# EAGLE design weatherstation (EAGLE 7.1.0)
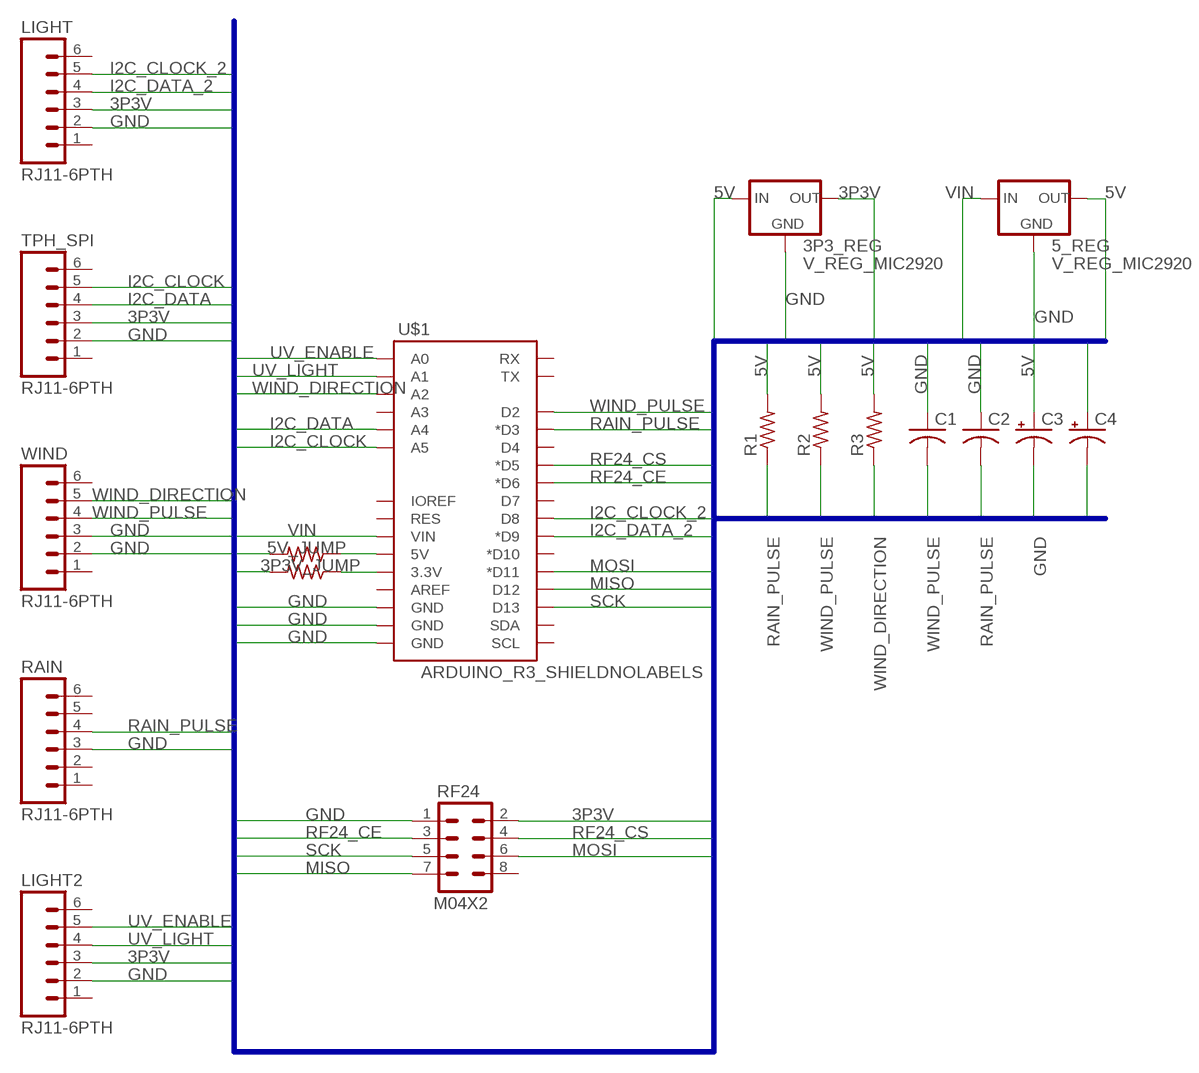
[diagram p0: schematic, sheet 1]

## Parts
3P3_REG  V_REG_MIC2920  [SOT223]
3P3V_JUMP  R-US_R0805  [R0805]
5_REG  V_REG_MIC2920  [SOT223]
5V_JUMP  R-US_R0805  [R0805]
C1  C-USC0805  [C0805]
C2  C-USC0805  [C0805]
C3  CPOL-USE2.5-6  [E2,5-6]
C4  CPOL-USE2.5-6  [E2,5-6]
LIGHT  RJ11-6PTH  [RJ11-6]
LIGHT2  RJ11-6PTH  [RJ11-6]
R1  R-US_R0805  [R0805]
R2  R-US_R0805  [R0805]
R3  R-US_R0805  [R0805]
RAIN  RJ11-6PTH  [RJ11-6]
RF24  M04X2  [2X4]
TPH_SPI  RJ11-6PTH  [RJ11-6]
U$1  ARDUINO_R3_SHIELDNOLABELS  [UNO_R3_SHIELD_NOLABELS]
WIND  RJ11-6PTH  [RJ11-6]

## Nets
3P3V: 3P3_REG.3(OUT) 3P3V_JUMP.2 C4.+ LIGHT2.3 LIGHT.3 RF24.2 TPH_SPI.3
5V: 3P3_REG.1(IN) 5_REG.3(OUT) 5V_JUMP.2 C3.+ R1.2 R2.2 R3.2
GND: 3P3_REG.2(GND) 5_REG.2(GND) C1.1 C2.1 C3.- C4.- LIGHT2.2 LIGHT.2 RAIN.3 RF24.1 TPH_SPI.2 U$1.GND@0(GND) U$1.GND@1(GND) U$1.GND@2(GND) WIND.2 WIND.3
I2C_CLOCK: TPH_SPI.5 U$1.A5
I2C_CLOCK_2: LIGHT.5 U$1.D8
I2C_DATA: TPH_SPI.4 U$1.A4
I2C_DATA_2: LIGHT.4 U$1.D9(*D9)
MISO: RF24.7 U$1.D12
MOSI: RF24.6 U$1.D11(*D11)
N$2: 3P3V_JUMP.1 U$1.3.3V
N$3: 5V_JUMP.1 U$1.5V
RAIN_PULSE: C2.2 R1.1 RAIN.4 U$1.D3(*D3)
RF24_CE: RF24.3 U$1.D6(*D6)
RF24_CS: RF24.4 U$1.D5(*D5)
SCK: RF24.5 U$1.D13
UV_ENABLE: LIGHT2.5 U$1.A0
UV_LIGHT: LIGHT2.4 U$1.A1
VIN: 5_REG.1(IN) U$1.VIN
WIND_DIRECTION: R3.1 U$1.A2 WIND.5
WIND_PULSE: C1.2 R2.1 U$1.D2 WIND.4
Unconnected: LIGHT2.1 LIGHT2.6 LIGHT.1 LIGHT.6 RAIN.1 RAIN.2 RAIN.5 RAIN.6 RF24.8 TPH_SPI.1 TPH_SPI.6 U$1.A3 U$1.AREF U$1.D4 U$1.D7 U$1.D10(*D10) U$1.IOREF U$1.RES U$1.RX U$1.SCL U$1.SDA U$1.TX WIND.1 WIND.6

## Buses
UV_LIGHT,UV_ENABLE,WIND_PULSE,RAIN_PULSE,GND,3P3V,5V,VIN,WIND_DIRECTION,I2C_DATA,I2C_DATA_2,I2C_CLOCK,I2C_CLOCK_2,MOSI,MISO,SCK,RF24_CS,RF24_CE

## Library data of the parts
3P3_REG 5_REG = SparkFun-PowerIC:V_REG_MIC2920: MIC2920A (http://www.micrel.com/_PDF/mic2920.pdf) - 400mA output LDO Regulator
3P3V_JUMP 5V_JUMP R1-R3 = rcl:R-US_: RESISTOR, American symbol
C1 C2 = rcl:C-US: CAPACITOR, American symbol
C3 C4 = rcl:CPOL-US: POLARIZED CAPACITOR, American symbol
LIGHT LIGHT2 RAIN TPH_SPI WIND = SparkFun-Connectors:RJ11-6: RJ11 Jack Simple 6 pin RJ11 jack. Commonly found on CAT3 devices and Microchip programmers. SKU: PRT-00132
RF24 = SparkFun-Connectors:M04X2: .1" header, two rows of four.
U$1 = SparkFun-Boards:ARDUINO_R3_SHIELD: Shield form compatible with the Arduino Uno R3.

## Board
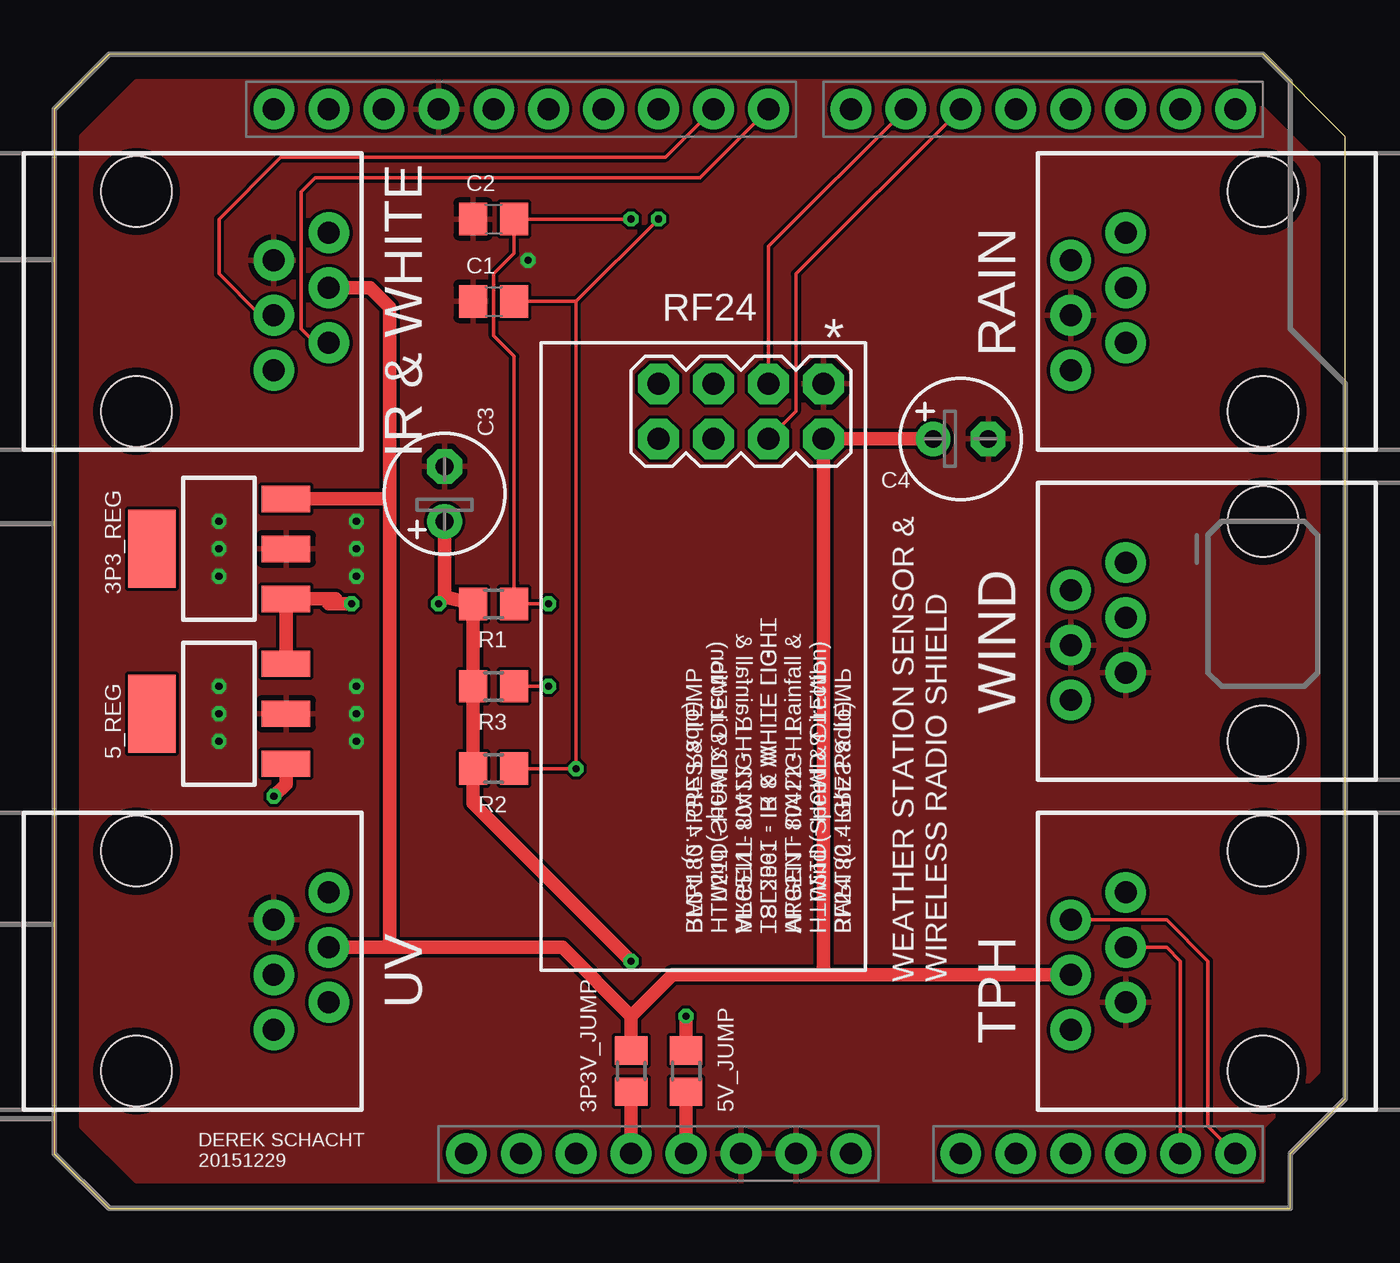
[diagram p1: board, top side]
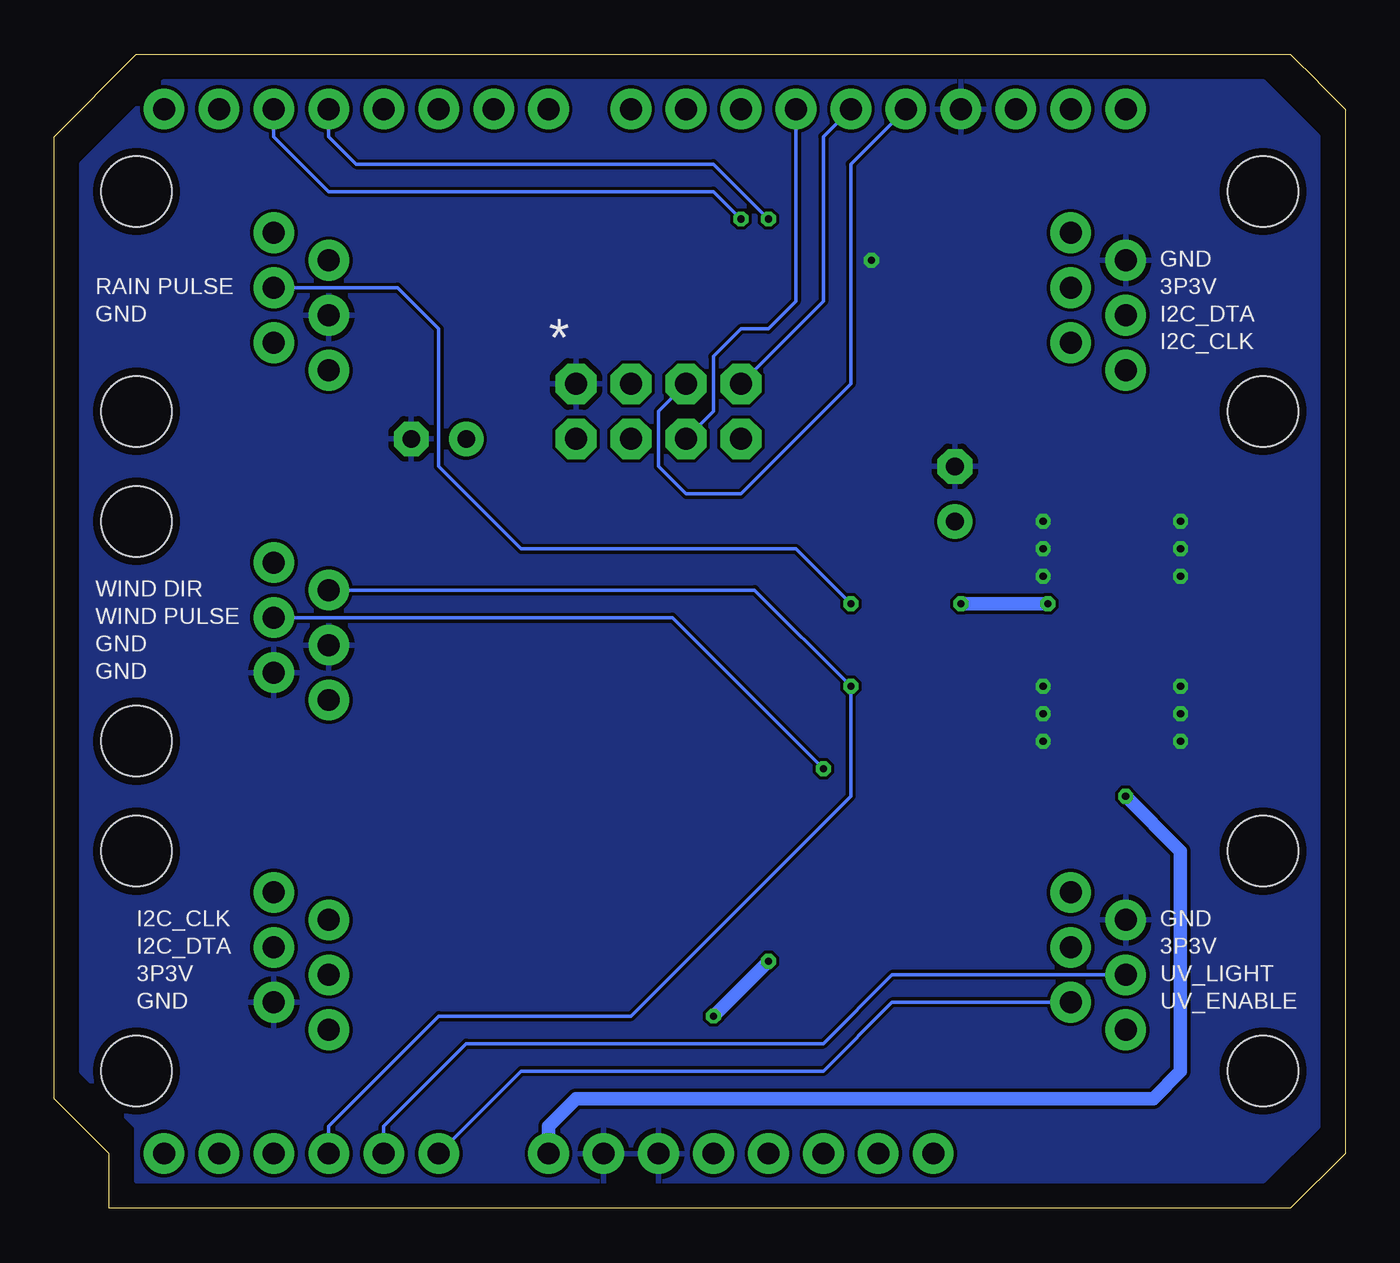
[diagram p2: board, bottom side, seen from below]

Size 59.69 x 53.34 mm. Coordinates in mm from the lower left corner, seen from the top.
Outline: 0,2.54 2.54,0 57.14,0 57.14,2.53 59.69,5.08 59.68,49.52 55.89,53.33 55.56,53.34 2.54,53.34 1.26,52.06 1.27,52.06 0,50.8 0,2.54
Copper layers (1*16): Top 0.0356mm / dielectric 1.5011mm / Bottom 0.0356mm
Design rules "LaenPCBOrder": minimum track width 6mil, minimum drill 13mil, track to track 6mil, track to pad 6mil, pad to pad 6mil, via to via 6mil, smd to smd 6mil, copper to edge 15mil, drill to drill 6mil, minimum pad ring 7mil, minimum via ring 7mil, stop-mask expansion 3mil, vias tented up to drill 0mil, thermal gap 10mil

### Footprints (pad centres in the part's own frame; a part is rotated, then mirrored left to right if it is on the bottom)
SOT223 = smd 1.219 x 2.235: 1 -2.311,-3.099; 2 0,-3.099; 3 2.311,-3.099 | smd 3.6 x 2.2: 4 0,3.099
R0805 = smd 1.3 x 1.5: 1 -0.95,0; 2 0.95,0
C0805 = smd 1.3 x 1.5: 1 -0.95,0; 2 0.95,0
E2,5-6 = drill 0.813 pad 1.6: + -1.27,0 | drill 0.813 pad 1.6 octagon: - 1.27,0
RJ11-6 = drill 1.016 pad 1.88: 1 1.905,8.89; 2 3.175,6.35; 3 4.445,8.89; 4 5.715,6.35; 5 6.985,8.89; 6 8.255,6.35 | hole 3.251: 0,0; 10.16,0
2X4 = drill 1.016 pad 1.88 octagon: 1 -3.81,-1.27; 2 -3.81,1.27; 3 -1.27,-1.27; 4 -1.27,1.27; 5 1.27,-1.27; 6 1.27,1.27; 7 3.81,-1.27; 8 3.81,1.27
UNO_R3_SHIELD_NOLABELS = drill 1.016 pad 1.88: 3.3V 50.8,26.67; 5V 50.8,29.21; A0 50.8,41.91; A1 50.8,44.45; A2 50.8,46.99; A3 50.8,49.53; A4 50.8,52.07; A5 50.8,54.61; AREF 2.54,15.24; D2 2.54,49.53; D3 2.54,46.99; D4 2.54,44.45; D5 2.54,41.91; D6 2.54,39.37; D7 2.54,36.83; D8 2.54,33.02; D9 2.54,30.48; D10 2.54,27.94; D11 2.54,25.4; D12 2.54,22.86; D13 2.54,20.32; GND@0 50.8,31.75; GND@1 50.8,34.29; GND@2 2.54,17.78; IOREF 50.8,21.59; NC 50.8,19.05; RES 50.8,24.13; RX 2.54,54.61; SCL 2.54,10.16; SDA 2.54,12.7; TX 2.54,52.07; VIN 50.8,36.83

### Placement (x,y rotation side)
3P3_REG  7.62,30.48 90 top
3P3V_JUMP  26.67,6.35 90 top
5_REG  7.62,22.86 90 top
5V_JUMP  29.21,6.35 90 top
C1  20.32,41.91 0 top
C2  20.32,45.72 0 top
C3  18.05,33.02 90 top
C4  41.91,35.56 0 top
LIGHT  3.81,46.99 270 top
LIGHT2  3.81,16.51 270 top
R1  20.32,27.94 180 top
R2  20.32,20.32 180 top
R3  20.32,24.13 180 top
RAIN  55.88,36.83 90 top
RF24  31.75,36.83 180 top
TPH_SPI  55.88,6.35 90 top
U$1  0,53.34 270 top
WIND  55.88,21.59 90 top

### Tracks (layer width: path | path; a pad name or v marks a point on that pad's centre or on a via)
3P3V
  Top 0.635: LIGHT.3 14.61,42.55 15.51,41.64 15.51,32.79 | 15.51,32.79 15.51,12.06 | TPH_SPI.3 35.56,10.79 | 35.56,10.79 RF24.2 C4.+ | LIGHT2.3 15.51,12.06 | 26.67,8.89 28.57,10.79 35.56,10.79 | 15.51,12.06 23.5,12.06 26.67,8.89 | 3P3_REG.3 15.51,32.79 | 26.67,8.89 3P3V_JUMP.2
5V  (via drill 0.33)
  Top 0.635: C3.+ 18.05,28.26 | 18.05,28.26 R1.2 R3.2 R2.2 19.37,18.73 v26.67,11.43 | 5_REG.3 3P3_REG.1 13.02,28.17 13.02,27.94 | 18.05,28.26 18.1,28.26 v17.78,27.94 | v13.76,27.94 13.02,27.94 | 12.7,27.94 13.02,27.94 | v29.21,8.89 5V_JUMP.2
  Bottom 0.635: v26.67,11.43 v29.21,8.89 | v17.78,27.94 v13.76,27.94
GND  (via drill 0.33)
  other vias: 13.97,31.75 13.97,30.48 13.97,29.21 7.62,29.21 7.62,30.48 7.62,31.75 7.62,22.86 7.62,24.13 7.62,21.59 13.97,21.59 13.97,22.86 13.97,24.13 21.91,43.81
  pour Top: 1.27,49.53 1.27,3.81 3.81,1.27 55.88,1.27 55.88,3.81 58.42,6.35 58.42,48.26 54.61,52.07 3.81,52.07
  pour Bottom: 1.27,49.53 1.27,3.81 3.81,1.27 55.88,1.27 55.88,3.81 58.42,6.35 58.42,48.26 54.61,52.07 3.81,52.07
I2C_CLOCK
  Top 0.152: TPH_SPI.5 51.44,13.34 53.34,11.43 53.34,3.81 U$1.A5
I2C_CLOCK_2
  Top 0.152: LIGHT.5 12.06,40.01 11.43,40.64 11.43,46.99 12.06,47.62 29.84,47.62 U$1.D8
I2C_DATA
  Top 0.152: TPH_SPI.4 51.44,12.06 52.07,11.43 U$1.A4
I2C_DATA_2
  Top 0.152: LIGHT.4 9.53,41.27 7.62,43.18 7.62,45.72 10.48,48.58 28.26,48.58 U$1.D9
MISO
  Bottom 0.152: U$1.D12 24.13,49.53 24.13,41.91 RF24.7
MOSI
  Bottom 0.152: U$1.D11 25.4,41.91 26.67,40.64 27.94,40.64 29.21,39.37 29.21,36.83 RF24.6
N$2
  Top 0.635: 3P3V_JUMP.1 U$1.3.3V
N$3
  Top 0.635: U$1.5V 5V_JUMP.1
RAIN_PULSE  (via drill 0.33)
  Top 0.152: v26.67,45.72 C2.2 21.27,44.13 20.32,43.18 20.32,40.32 21.27,39.37 21.27,28.89 R1.1 v22.86,27.94
  Bottom 0.152: U$1.D3 46.99,49.53 45.72,48.26 29.21,48.26 v26.67,45.72 | RAIN.4 43.81,42.55 41.91,40.64 41.91,34.29 38.1,30.48 25.4,30.48 v22.86,27.94
RF24_CE
  Top 0.152: RF24.3 33.02,44.45 U$1.D6
RF24_CS
  Top 0.152: U$1.D5 34.29,43.18 34.29,36.83 RF24.4
SCK
  Bottom 0.152: U$1.D13 22.86,48.26 22.86,38.1 27.94,33.02 30.48,33.02 31.75,34.29 31.75,36.83 RF24.5
UV_ENABLE
  Bottom 0.152: LIGHT2.5 20.95,9.53 24.13,6.35 38.1,6.35 U$1.A0
UV_LIGHT
  Bottom 0.152: U$1.A1 44.45,3.81 40.64,7.62 24.13,7.62 20.95,10.79 LIGHT2.4
VIN  (via drill 0.33)
  Top 0.635: 5_REG.1 10.72,19.61 v10.16,19.05
  Bottom 0.635: U$1.VIN 36.83,3.81 35.56,5.08 8.89,5.08 7.62,6.35 7.62,16.51 v10.16,19.05
WIND_DIRECTION  (via drill 0.33)
  Top 0.152: R3.1 v22.86,24.13
  Bottom 0.152: WIND.5 27.3,28.57 v22.86,24.13 22.86,19.05 33.02,8.89 41.91,8.89 46.99,3.81 U$1.A2
WIND_PULSE  (via drill 0.33)
  Top 0.152: R2.1 v24.13,20.32 24.13,41.91 | 21.59,41.91 C1.2 24.13,41.91 | 24.13,41.91 v27.94,45.72
  Bottom 0.152: WIND.4 31.11,27.3 v24.13,20.32 | U$1.D2 49.53,49.53 46.99,46.99 29.21,46.99 v27.94,45.72

### Text on the board
tNames: IR & WHITE | * | RAIN | WIND | UV | BMP180 - PRES & TEMP / HTU21D - HUMD & TEMP / ML8511 - UV LIGHT / TSL2561 - IR & WHITE LIGHT / ARGENT 80422 - Rainfall & / Wind (Speed & Direction) / RF24 (2.4 Ghz Radio) | BMP180 - PRES & TEMP / HTU21D - HUMD & TEMP / ML8511 - UV LIGHT / TSL2561 - IR & WHITE LIGHT / ARGENT 80422 - Rainfall & / Wind (Speed & Direction) / RF24 (2.4 Ghz Radio) | WEATHER STATION SENSOR & / WIRELESS RADIO SHIELD | TPH | DEREK SCHACHT / 20151229
bNames: GND | 3P3V | RAIN PULSE | I2C_DTA | GND | I2C_CLK | * | WIND DIR | WIND PULSE | GND | GND | GND | I2C_CLK | 3P3V | I2C_DTA | UV_LIGHT | 3P3V | UV_ENABLE | GND